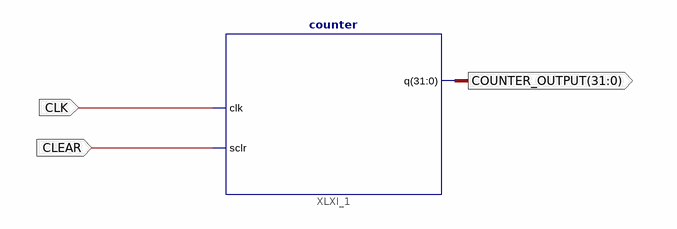
[diagram p0: schematic sheet 1]
// Xilinx ISE schematic mips_schematic.sch (spartan3) as structural Verilog: 1 symbols, 3 ports
module mips_schematic (
  input  CLK,
  input  CLEAR,
  output [31:0] COUNTER_OUTPUT
);

  counter XLXI_1 (.clk(CLK), .sclr(CLEAR), .q(COUNTER_OUTPUT));
endmodule
